# EAGLE design single (EAGLE 9.1.1)
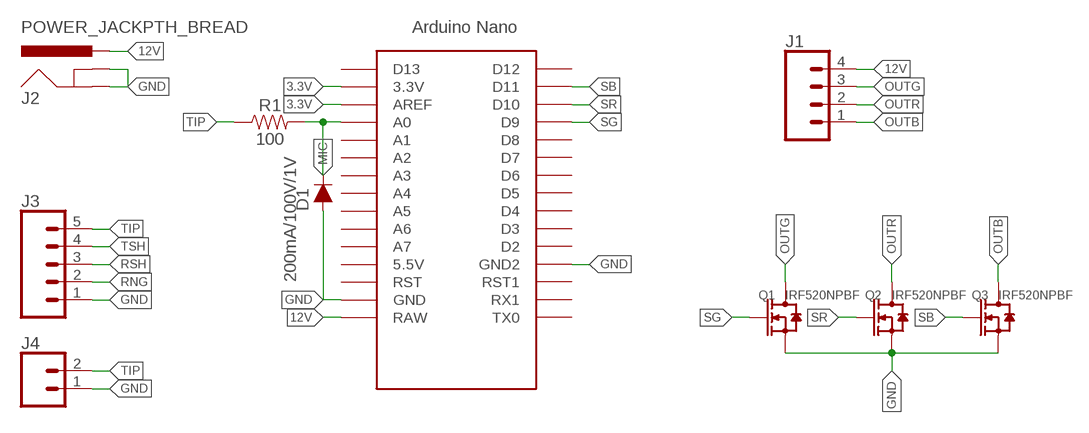
[diagram p0: schematic, sheet 1]

## Parts
D1  200mA/100V/1V  DIODE-1N4148  [DIODE-1N4148]
J1  CONN_04LOCK_LONGPADS  [1X04_LOCK_LONGPADS]
J2  POWER_JACKPTH_BREAD  [POWER_JACK_PTH_BREAD]
J3  CONN_05LOCK_LONGPADS  [1X05_LOCK_LONGPADS]
J4  CONN_02LOCK_LONGPADS  [1X02_LOCK_LONGPADS]
Q1  IRF520NPBF  DIP-MOSFET-N-CH-100V-9.7A-IRF520NPBF(TO-220AB)  [TO-220]
Q2  IRF520NPBF  DIP-MOSFET-N-CH-100V-9.7A-IRF520NPBF(TO-220AB)  [TO-220]
Q3  IRF520NPBF  DIP-MOSFET-N-CH-100V-9.7A-IRF520NPBF(TO-220AB)  [TO-220]
R1  100  100OHM-HORIZ-1/4W-1%  [AXIAL-0.3]
U$1  NANONOICSP  [NANO_2]

## Nets
3.3V: U$1.3.3V U$1.AREF
12V: J1.4 J2.PWR U$1.RAW
GND: D1.A J2.GND J2.GNDBREAK J3.1 J4.1 Q1.2(S) Q1.HEAT(S) Q2.2(S) Q2.HEAT(S) Q3.2(S) Q3.HEAT(S) U$1.GND U$1.GND1(GND2)
MIC: D1.C R1.P$2 U$1.A0
OUTB: J1.1 Q3.3(D)
OUTG: J1.3 Q1.3(D)
OUTR: J1.2 Q2.3(D)
RNG: J3.2
RSH: J3.3
SB: Q3.1(G) U$1.D11
SG: Q1.1(G) U$1.D9
SR: Q2.1(G) U$1.D10
TIP: J3.5 J4.2 R1.P$1
TSH: J3.4
Unconnected: U$1.5V(5.5V) U$1.A1 U$1.A2 U$1.A3 U$1.A4 U$1.A5 U$1.A6 U$1.A7 U$1.D2 U$1.D3 U$1.D4 U$1.D5 U$1.D6 U$1.D7 U$1.D8 U$1.D12 U$1.D13 U$1.RST U$1.RST1 U$1.RX1 U$1.TX0

## Library data of the parts
D1 = SparkFun-DiscreteSemi:DIODE: Diode These are standard reverse protection diodes and small signal diodes. SparkFun Products: SparkFun SparkPunk Sound Kit <https://www.sparkfun.com/products/11177> SparkFun ESP8266 Thing <https://www.sparkfun.com/products/13231>; PROD_ID: DIO-08378
J1 = SparkFun-Connectors:CONN_04: Multi connection point. Often used as Generic Header-pin footprint for 0.1 inch spaced/style header connections On any of the 0.1 inch spaced packages, you can populate with these: Break Away Headers - Straight <https://www.sparkfun.com/products/116> (PRT-00116) Break Away Male Headers - Right Angle <https://www.sparkfun.com/products/553> (PRT-00553) Female Headers <https://www.sparkfun.com/products/115> (PRT-00115) Break Away Headers - Machine Pin <https://www.sparkfun.com/products/117> (PRT-00117) Break Away Female Headers - Swiss Machine Pin <https://www.sparkfun.com/products/743> (PRT-00743) For SCREWTERMINALS and SPRING TERMINALS visit here: Screw Terimnals on SparkFun.com <https://www.sparkfun.com/search/results?term=Screw+Terminals> (5mm/3.5mm/2.54mm spacing) This device is also useful as a general connection point to wire up your design to another part of your project. Our various solder wires solder well into these plated through hole pads. Hook-Up Wire - Assortment (Stranded, 22 AWG) <https://www.sparkfun.com/products/11375> (PRT-11375) Hook-Up Wire - Assortment (Solid Core, 22 AWG) <https://www.sparkfun.com/products/11367> (PRT-11367) View the entire wire category on our website here <https://www.sparkfun.com/categories/141> Special notes: Molex polarized connector foot print use with SKU : PRT-08231 with associated crimp pins and housings. 1MM SMD Version SKU: PRT-10208; PROD_ID: CONN-09696
J2 = SparkFun-Connectors:POWER_JACK: Power Jack Connector This is the standard 5.5mm barrel jack for power. The PTH is the most common, proven, reliable, footprint. The Slot footprint only works if the mill layer is transmitted to the PCB fab house so be warned. Here are the connectors we sell at SparkFun: DC Barrel Power Jack/Connector <https://www.sparkfun.com/products/119> (PRT-00119) DC Barrel Power Jack/Connector (SMD) <https://www.sparkfun.com/products/12748> (PRT-12748) DC Barrel Jack Adapter - Breadboard Compatible <https://www.sparkfun.com/products/10811> (PRT-10811) It is used on this SparkFun product (and many, many others): SparkFun RedBoard - Programmed with Arduino <https://www.sparkfun.com/products/12757> (DEV-12757) Also, if you need a mating power supply or connector, please check these out: Wall Adapter Power Supply - 9VDC 650mA <https://www.sparkfun.com/products/298> (TOL-00298) DC Barrel Jack Adapter - Male <https://www.sparkfun.com/products/10287> (PRT-10287); PROD_ID: PRT-10811
J3 = SparkFun-Connectors:CONN_05: Multi connection point. Often used as Generic Header-pin footprint for 0.1 inch spaced/style header connections On any of the 0.1 inch spaced packages, you can populate with these: Break Away Headers - Straight <https://www.sparkfun.com/products/116> (PRT-00116) Break Away Male Headers - Right Angle <https://www.sparkfun.com/products/553> (PRT-00553) Female Headers <https://www.sparkfun.com/products/115> (PRT-00115) Break Away Headers - Machine Pin <https://www.sparkfun.com/products/117> (PRT-00117) Break Away Female Headers - Swiss Machine Pin <https://www.sparkfun.com/products/743> (PRT-00743) For SCREWTERMINALS and SPRING TERMINALS visit here: Screw Terimnals on SparkFun.com <https://www.sparkfun.com/search/results?term=Screw+Terminals> (5mm/3.5mm/2.54mm spacing) This device is also useful as a general connection point to wire up your design to another part of your project. Our various solder wires solder well into these plated through hole pads. Hook-Up Wire - Assortment (Stranded, 22 AWG) <https://www.sparkfun.com/products/11375> (PRT-11375) Hook-Up Wire - Assortment (Solid Core, 22 AWG) <https://www.sparkfun.com/products/11367> (PRT-11367) View the entire wire category on our website here <https://www.sparkfun.com/categories/141> Special notes: Molex polarized connector foot print use with SKU : PRT-08231 with associated crimp pins and housings. 1MM SMD Version SKU: PRT-10208
J4 = SparkFun-Connectors:CONN_02: Multi connection point. Often used as Generic Header-pin footprint for 0.1 inch spaced/style header connections On any of the 0.1 inch spaced packages, you can populate with these: Break Away Headers - Straight <https://www.sparkfun.com/products/116> (PRT-00116) Break Away Male Headers - Right Angle <https://www.sparkfun.com/products/553> (PRT-00553) Female Headers <https://www.sparkfun.com/products/115> (PRT-00115) Break Away Headers - Machine Pin <https://www.sparkfun.com/products/117> (PRT-00117) Break Away Female Headers - Swiss Machine Pin <https://www.sparkfun.com/products/743> (PRT-00743) For SCREWTERMINALS and SPRING TERMINALS visit here: Screw Terimnals on SparkFun.com <https://www.sparkfun.com/search/results?term=Screw+Terminals> (5mm/3.5mm/2.54mm spacing) This device is also useful as a general connection point to wire up your design to another part of your project. Our various solder wires solder well into these plated through hole pads. Hook-Up Wire - Assortment (Stranded, 22 AWG) <https://www.sparkfun.com/products/11375> (PRT-11375) Hook-Up Wire - Assortment (Solid Core, 22 AWG) <https://www.sparkfun.com/products/11367> (PRT-11367) View the entire wire category on our website here <https://www.sparkfun.com/categories/141> Special notes: Molex polarized connector foot print use with: PRT-08233 with associated crimp pins and housings. 2.54_SCREWTERM for use with PRT-10571. 3.5mm Screw Terminal footprints for PRT-08084 5mm Screw Terminal footprints for use with PRT-08432
Q1-Q3 = Seeed-Transistor:DIP-MOSFET-N-CH-100V-9.7A-IRF520NPBF(TO-220AB): 305030059; MPN: IRF520NPBF
R1 = SparkFun-Resistors:100OHM: 100Ω resistor A resistor is a passive two-terminal electrical component that implements electrical resistance as a circuit element. Resistors act to reduce current flow, and, at the same time, act to lower voltage levels within circuits. - Wikipedia; PROD_ID: RES-12181
U$1 = Arduino-clone:NANO: Arduino Nano

## Board
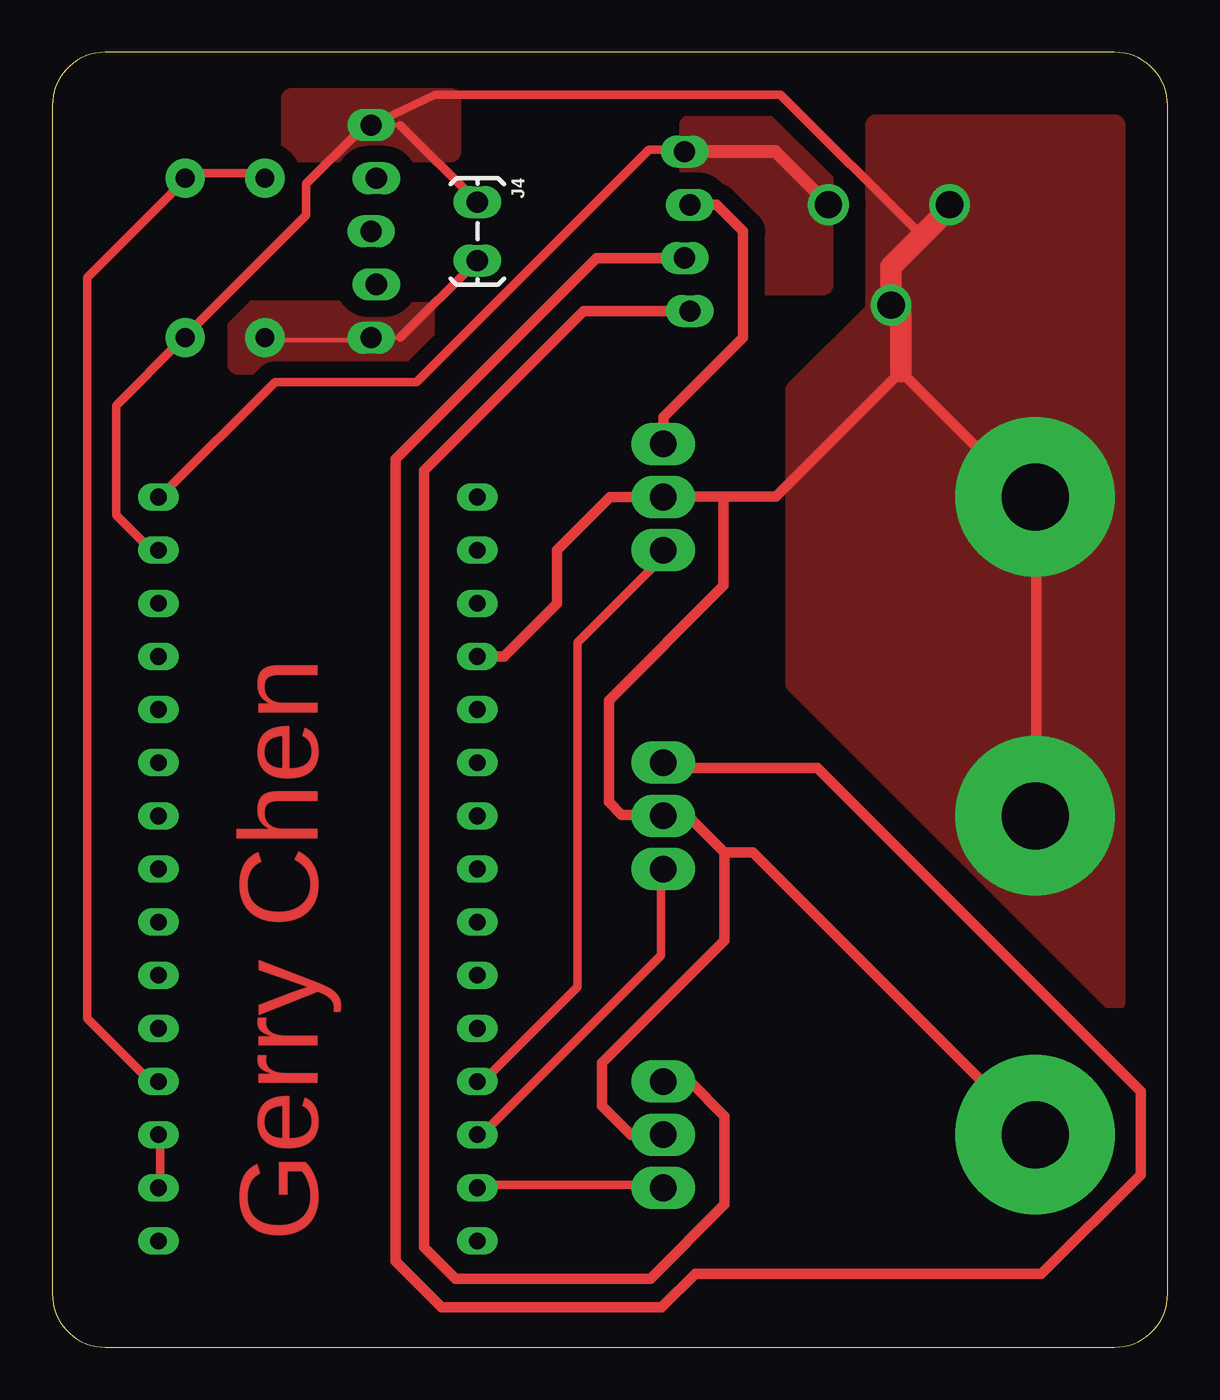
[diagram p1: board, top side]
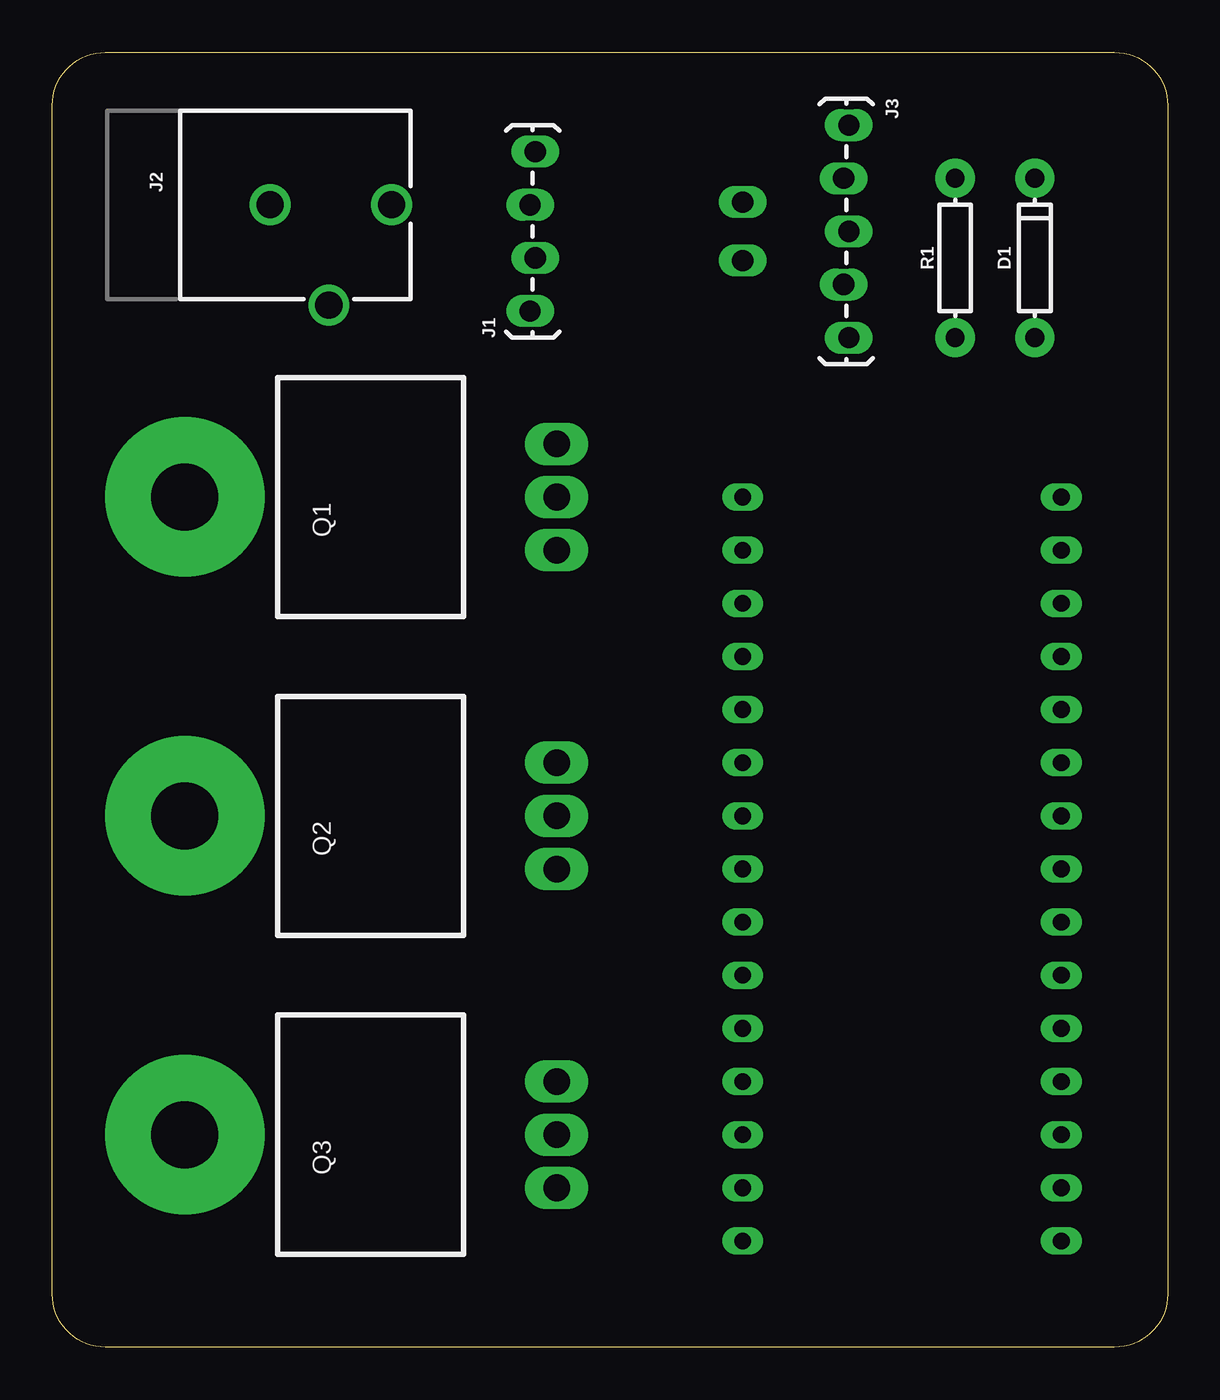
[diagram p2: board, bottom side, seen from below]

Size 53.32 x 61.9 mm. Coordinates in mm from the lower left corner, seen from the top.
Outline: 0,59.36 0,2.54 arc90 2.54,0 50.78,0 arc90 53.32,2.54 53.32,59.36 arc90 50.78,61.9 2.54,61.9 arc90 0,59.36
Copper layers (1*16): Top 0.035mm / dielectric 1.5mm / Bottom 0.035mm
Design rules "OthermillDRC_1_32_v2": minimum track width 8mil, minimum drill 0.8mm, track to track 0.794003125mm, track to pad 0.794003125mm, pad to pad 0.794003125mm, via to via 0.794003125mm, smd to smd 0mil, copper to edge 0mil, drill to drill 1mil, minimum pad ring 10mil, minimum via ring 10mil, stop-mask expansion 1mil, vias tented up to drill 30mil, thermal gap 10mil

### Footprints (pad centres in the part's own frame; a part is rotated, then mirrored left to right if it is on the bottom)
DIODE-1N4148 = drill 0.9 pad 1.88: A -3.81,0; C 3.81,0
1X04_LOCK_LONGPADS = drill 1.016 long: 1 0,0; 2 2.54,-0.254; 3 5.08,0; 4 7.62,-0.254
POWER_JACK_PTH_BREAD = drill 1.3: GND 0,7.9; GNDBREAK 4.8,10.7; PWR 0,13.7
1X05_LOCK_LONGPADS = drill 1.016 long: 1 0,0; 2 2.54,-0.254; 3 5.08,0; 4 7.62,-0.254; 5 10.16,0
1X02_LOCK_LONGPADS = drill 1.016 long: 1 -0.127,0; 2 2.667,0
TO-220 = drill 1.27 pad 2.032 long: 1 -2.54,-11.43; 2 0,-11.43; 3 2.54,-11.43 | drill 3.2 pad 7.62: HEAT 0,6.35
AXIAL-0.3 = drill 0.9 pad 1.88: P$1 -3.81,0; P$2 3.81,0
NANO_2 = drill 0.8 long: 3.3V -10.16,24.13; 5V -10.16,-1.27; A0 -10.16,19.05; A1 -10.16,16.51; A2 -10.16,13.97; A3 -10.16,11.43; A4 -10.16,8.89; A5 -10.16,6.35; A6 -10.16,3.81; A7 -10.16,1.27; AREF -10.16,21.59; D2 5.08,1.27; D3 5.08,3.81; D4 5.08,6.35; D5 5.08,8.89; D6 5.08,11.43; D7 5.08,13.97; D8 5.08,16.51; D9 5.08,19.05; D10 5.08,21.59; D11 5.08,24.13; D12 5.08,26.67; D13 -10.16,26.67; GND -10.16,-6.35; GND1 5.08,-1.27; RAW -10.16,-8.89; RST -10.16,-3.81; RST1 5.08,-3.81; RX1 5.08,-6.35; TX0 5.08,-8.89

### Placement (x,y rotation side)
D1  6.35,52.07 90 bottom
J1  30.48,49.53 90 bottom
J2  50.8,54.61 270 bottom
J3  15.24,58.42 270 bottom
J4  20.32,54.61 270 top
Q1  40.64,40.64 90 bottom
Q2  40.64,25.4 90 bottom
Q3  40.64,10.16 90 bottom
R1  10.16,52.07 90 bottom
U$1  15.24,31.75 180 bottom

### Tracks (layer width: path | path; a pad name or v marks a point on that pad's centre or on a via)
3.3V
  Top 0.406: U$1.3.3V 5.17,7.75 5.17,9.75 U$1.AREF
12V
  Top 0.203: 5.17,40.66 U$1.RAW | J1.4 30.12,57.25
  Top 0.406: 5.17,40.66 10.65,46.14 17.4,46.14 28.51,57.25 30.12,57.25
  Top 0.61: J2.PWR 34.56,57.15 J1.4
  pour Top (no thermals): 36.83,50.8 30.48,50.8 30.48,58.42 36.83,58.42
GND
  Top 0.203: D1.A 6.35,48.33 | 14.64,58.11 14.93,58.11 | 16.64,58.42 J3.1
  Top 0.406: U$1.GND 4.67,38.17 3.04,39.79 3.04,45.02 6.16,48.14 D1.A | 14.64,58.11 12.14,55.62 12.14,54.12 6.35,48.33 | 41.56,53.12 34.81,59.88 18.29,59.88 J3.1 14.93,58.11 | J4.1 16.64,58.42
  Top 0.508: 32.09,40.66 34.58,40.66 40.56,46.64 46.55,40.66 Q1.HEAT 47.05,40.16 47.05,25.7 Q2.HEAT | 32.09,40.66 29.6,40.66 Q1.2 26.67,40.64 24.13,38.1 24.13,35.56 21.59,33.02 U$1.GND1 | 32.09,40.66 32.09,36.4 26.61,30.91 26.61,26.05 27.21,25.45 29.16,25.45 Q2.2 30.39,25.4 32.14,23.65 | 32.14,23.65 32.14,19.44 26.28,13.58 26.28,11.53 27.66,10.15 Q3.2 | Q3.HEAT 33.5,23.65 32.14,23.65
  Top 1.016: J2.GND 42.56,54.12 41.56,53.12 40.1,51.66 J2.GNDBREAK 40.56,49.34 40.56,46.64
  pour Top (no thermals): 39.37,58.42 50.8,58.42 50.8,16.51 35.56,31.75 35.56,45.72 39.37,49.53
  pour Top (no thermals): 11.43,59.69 19.05,59.69 19.05,57.15 11.43,57.15
MIC
  Top 0.406: U$1.A0 4.67,12.74 1.68,15.73 1.68,51.13 6.16,55.62 D1.C 6.66,56.12 10.15,56.12 R1.P$2
OUTB
  Top 0.508: Q3.3 30.48,12.7 32.14,11.04 32.14,6.83 28.59,3.28 19.28,3.28 17.78,4.78 17.78,41.91 25.4,49.53 J1.1
OUTG
  Top 0.508: Q1.3 29.21,44.45 33.02,48.26 33.02,53.34 31.75,54.61 J1.3
OUTR
  Top 0.508: Q2.3 29.45,27.7 36.58,27.7 52.03,12.24 52.03,8.25 47.29,3.51 30.74,3.51 29.13,1.9 18.61,1.9 16.4,4.11 16.4,42.45 26.02,52.07 J1.2
SB
  Top 0.406: U$1.D11 20.62,7.75 29.1,7.75 Q3.1
SG
  Top 0.406: U$1.D9 20.62,12.74 25.11,17.23 25.11,33.68 29.1,37.67 Q1.1
SR
  Top 0.406: U$1.D10 20.62,10.24 29.1,18.72 29.1,22.75 Q2.1
TIP
  Top 0.203: R1.P$1 10.65,48.14 15.14,48.14 J3.5 16.64,48.26
  Top 0.406: J4.2 16.64,48.26
  pour Top (no thermals): 11.43,49.53 17.78,49.53 17.78,46.99 8.89,46.99 8.89,49.53

### Text on the board
Top: Gerry Chen